# EAGLE board lamloei_umo32c_r2_1 (EAGLE 7.7.0)
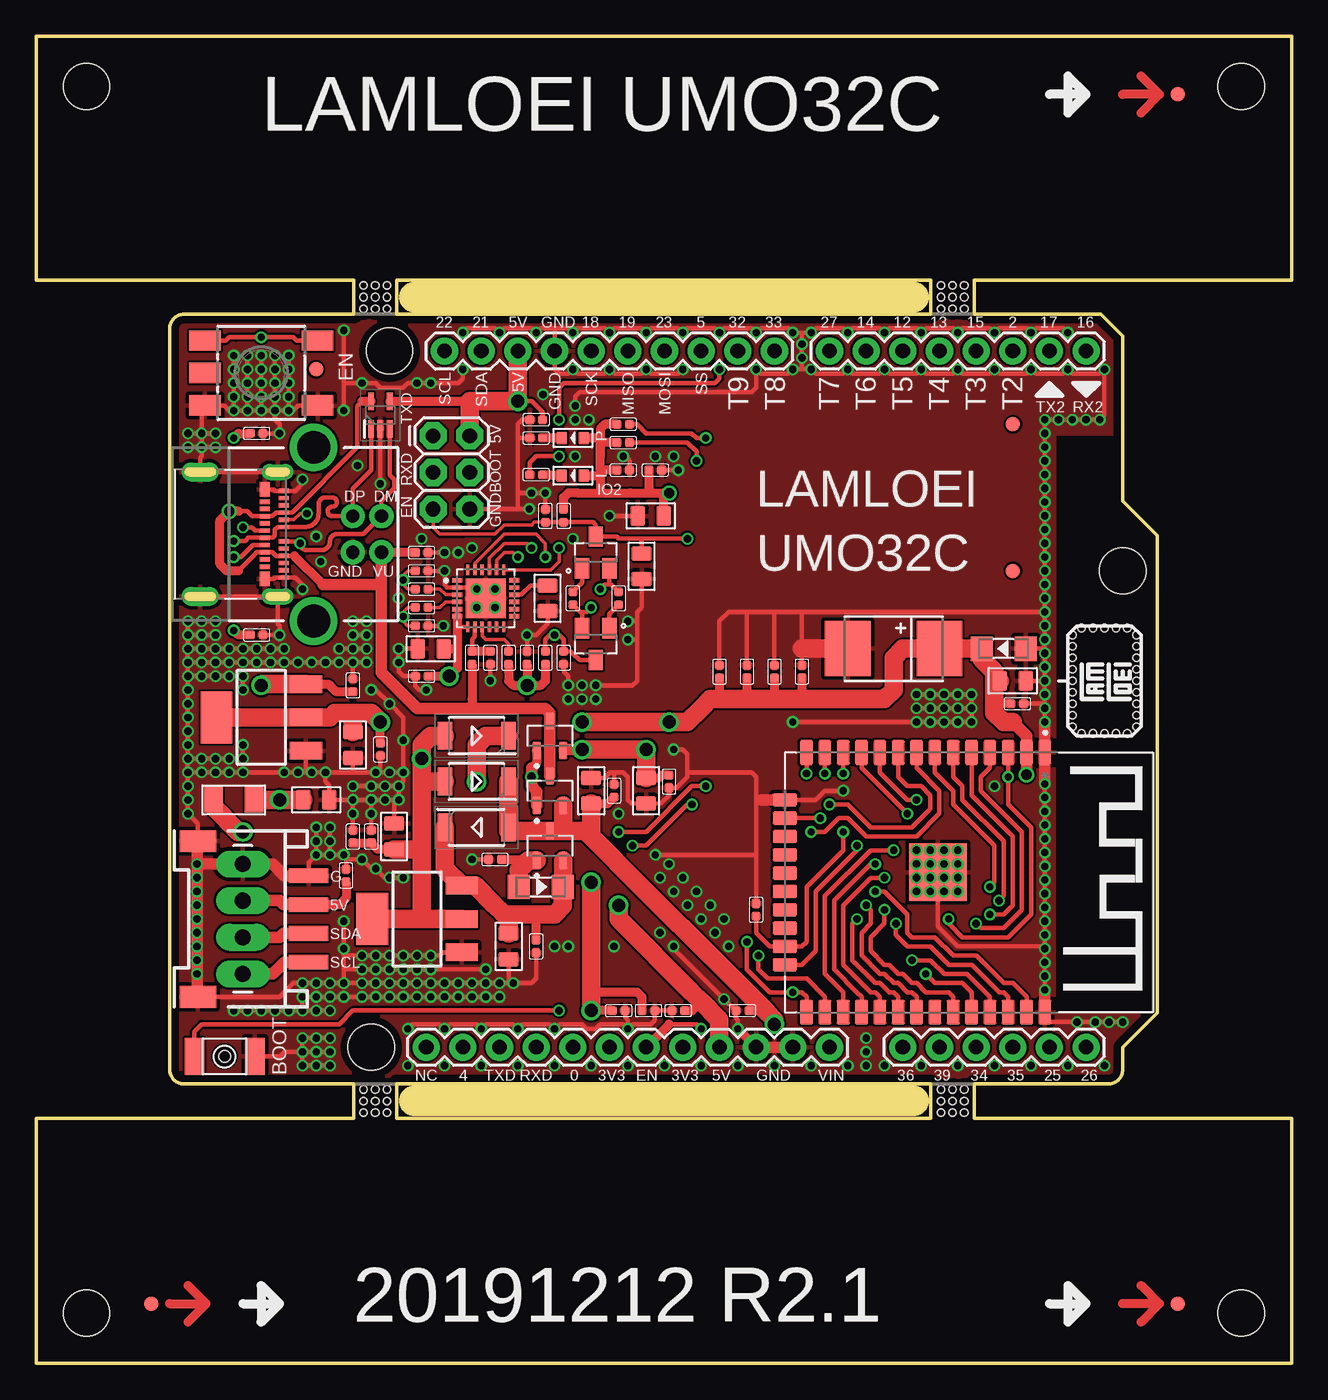
[diagram p1: board, top side]
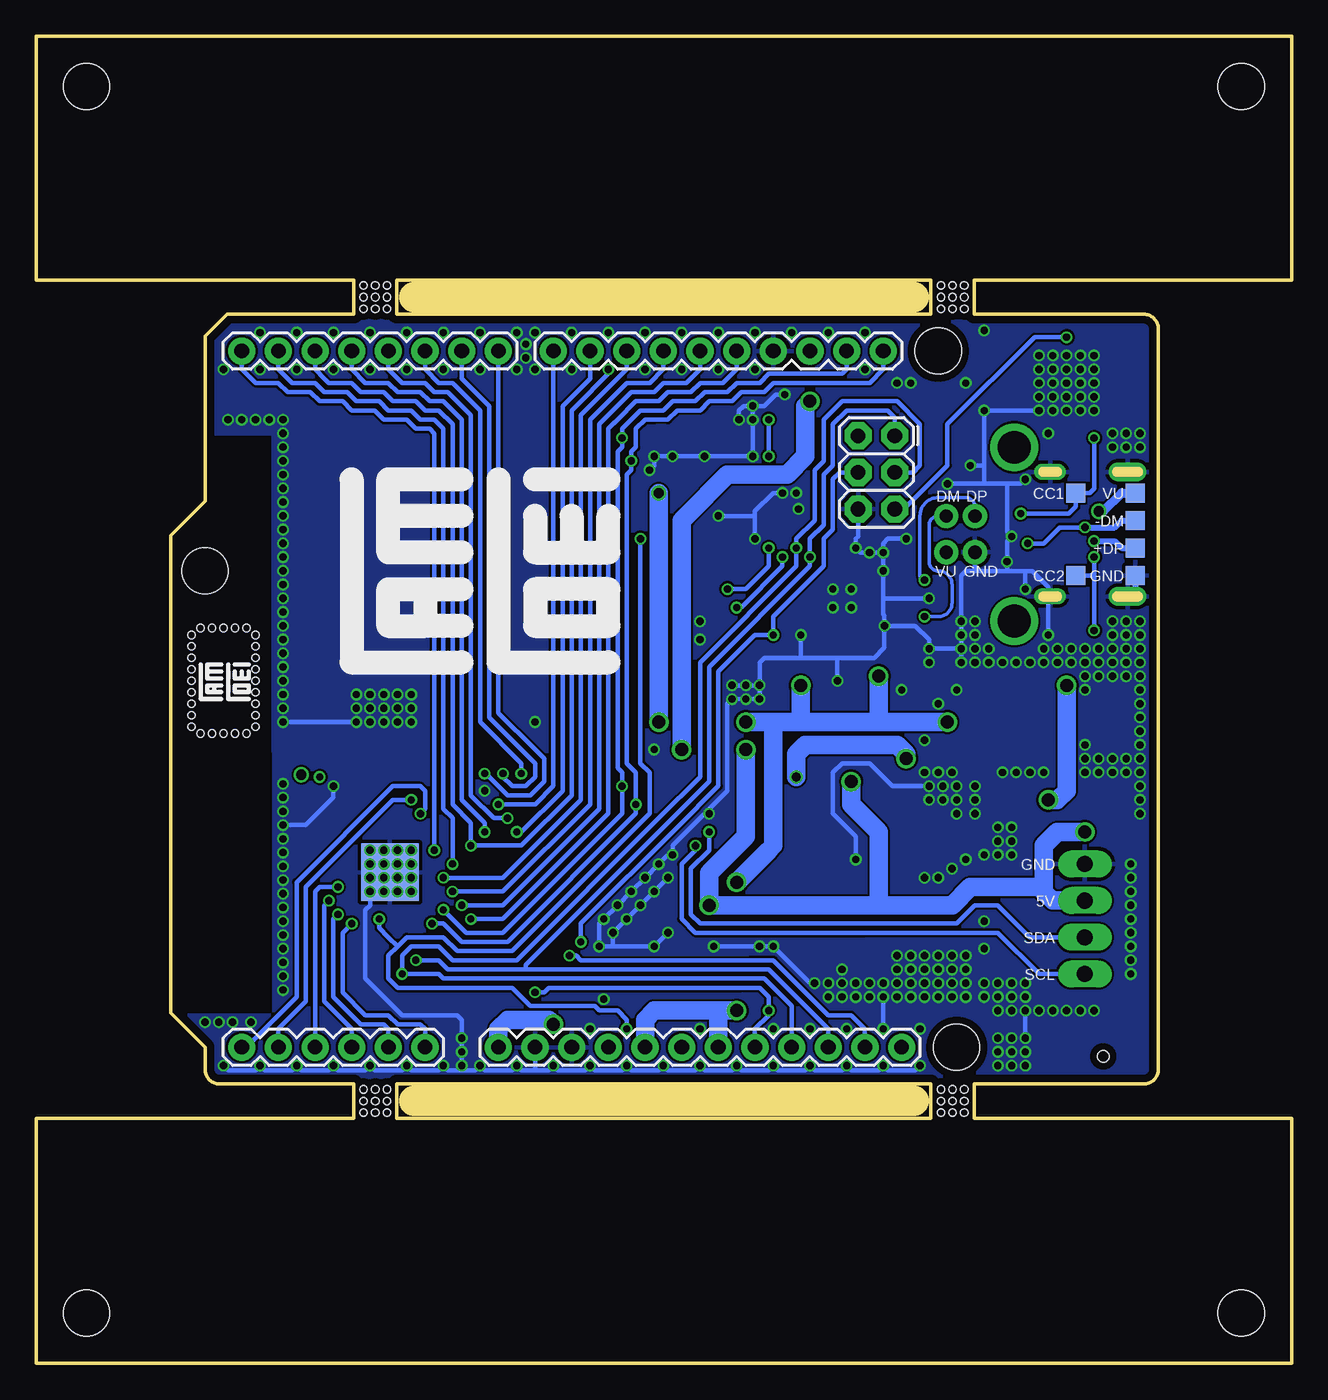
[diagram p2: board, bottom side, seen from below]

Size 87 x 92 mm. Coordinates in mm from the lower left corner, seen from the top.
Outline: 73.77,72.72 75.29,71.19 75.29,59.76 77.67,57.38 77.67,24.3 75.29,21.91 75.29,20.38 arc-90 74.29,19.38 65,19.38 65,17 87,17 87,0 0,0 0,17 22,17 22,19.38 10.25,19.38 arc-90 9.25,20.38
Outline: 9.25,20.39 9.25,71.72 arc-90 10.25,72.72 22,72.72 22,75.09 0,75.09 0,92 87,92 87,75.09 65,75.09 65,72.72 73.75,72.72
Outline: 62,19.38 25,19.38 25,17 62,17 62,19.38
Outline: 62,72.72 62,75.09 25,75.09 25,72.72 62,72.72
Copper layers (1*16): Top 0.035mm / dielectric 1.6mm / Bottom 0.035mm
Design rules "Elecrow_2-layer_PCB_eagle_rule-40": minimum track width 6mil, minimum drill 12mil, track to track 6mil, track to pad 6mil, pad to pad 6mil, via to via 8mil, smd to smd 0mil, copper to edge 20mil, drill to drill 10mil, minimum pad ring 6mil, minimum via ring 6mil, stop-mask expansion 0mil, vias tented up to drill 40mil, thermal gap 10mil
Net classes: 0 default: width 0.254 mm, clearance 0.152 mm; 1 power: width 0.61 mm, drill 0.61 mm, clearance 0.152 mm; 2 gnd: width 0.305 mm, drill 0.483 mm, clearance 0.152 mm; 3 usbvcc: width 0.508 mm, drill 0.61 mm, clearance 0.152 mm; 4 aref: width 0.406 mm, drill 0.61 mm, clearance 0.152 mm
Holes 3.2 mm at 75.29,54.94 24.49,70.17 23.22,21.91 3.5,88.5 3.5,3.5 83.5,88.5 83.5,3.5
Holes 0.8 mm at 13.06,21.28
Holes 0.5 mm at 23.5,19 22.69,19 24.31,19 63.5,19 64.31,19 62.69,19 22.69,18.19 22.69,17.38 23.5,17.38 23.5,18.19 24.31,18.19 24.31,17.38 63.5,18.19 62.69,18.19 62.69,17.38 63.5,17.38 64.31,17.38 64.31,18.19 63.5,73.09 23.5,73.09 24.31,73.09 22.69,73.09 23.5,73.91 24.31,73.91 22.69,73.91 22.69,74.72 23.5,74.72 24.31,74.72 64.31,73.09 62.69,73.09 63.5,73.91 64.31,73.91 62.69,73.91 62.69,74.72 63.5,74.72 64.31,74.72 72.43,43.66 71.8,44.14 73.23,43.66 74.02,43.66 74.81,43.66 75.61,43.66 76.24,44.14 71.8,44.93 71.8,45.73 71.8,46.52 71.8,47.31 71.8,48.11 71.8,48.9 71.8,50.49 71.8,49.7 72.43,50.97 73.23,50.97 74.02,50.97 74.81,50.97 75.61,50.97 76.24,50.49 76.24,44.93 76.24,45.73 76.24,46.52 76.24,47.31 76.24,48.11 76.24,48.9 76.24,49.7
Milling: 2 lines

## Footprints (pad centres in the part's own frame; a part is rotated, then mirrored left to right if it is on the bottom)
C0402 = smd 0.635 x 0.635: 1 0,0.445; 2 0,-0.445
C0805 = smd 1.397 x 1.016: 1 0,0.889; 2 0,-0.889
TE-D-7343 = smd 3.175 x 3.81: + 3.175,0; - -3.175,0
SODFL4725X110N = smd 1 x 1.93: 1 -2.2,0; 2 2.2,0
LL-34 = smd 1.524 x 1.676: A -1.524,0; C 1.524,0
F1206 = smd 1.27 x 1.778: 1 -1.397,0; 2 1.397,0
1X08 = drill 1.016 pad 1.88: 1 0,0; 2 2.54,0; 3 5.08,0; 4 7.62,0; 5 10.16,0; 6 12.7,0; 7 15.24,0; 8 17.78,0
1X10 = drill 1.016 pad 1.88: 1 0,0; 2 2.54,0; 3 5.08,0; 4 7.62,0; 5 10.16,0; 6 12.7,0; 7 15.24,0; 8 17.78,0; 9 20.32,0; 10 22.86,0
1X06 = drill 1.016 pad 1.88: 1 0,0; 2 2.54,0; 3 5.08,0; 4 7.62,0; 5 10.16,0; 6 12.7,0
1X12 = drill 1.016 pad 1.88: 1 0,0; 2 2.54,0; 3 5.08,0; 4 7.62,0; 5 10.16,0; 6 12.7,0; 7 15.24,0; 8 17.78,0; 9 20.32,0; 10 22.86,0; 11 25.4,0; 12 27.94,0
2X3 = drill 1.016 pad 1.88 octagon: 1 0,0; 2 0,2.54; 3 2.54,0; 4 2.54,2.54; 5 5.08,0; 6 5.08,2.54
HW4-SMD-2.0-90D = smd 1.01 x 2.74: 1 -3,-0.1; 2 -1,-0.1; 3 1,-0.1; 4 3,-0.1 | smd 1.5 x 2.54: SS1 -5.4,7.559; SS2 5.4,7.559
1X04_LONGPADS = drill 1.118 pad 1.88 long: 1 0,0; 2 2.54,0; 3 5.08,0; 4 7.62,0
SKHM = smd 2.2 x 1.4: 1 -3.9,2.25; 2 3.9,2.25; 3 -3.9,-2.25; 4 3.9,-2.25; 5 3.9,0
SW2-SMD-3.0X2.5X1.2+0.4MM = smd 1.346 x 2.54: 1 -2.095,0; 2 2.095,0
LED-0603 = smd 0.762 x 0.889: + -0.762,0; - 0.762,0
SOT23 = smd 1.4 x 1: 1 -1.1,0.95; 2 -1.1,-0.95; 3 1.1,0
SOT91P240X110-3N_DMG2305UX-7 = smd 1.18 x 0.61: 1 -1.025,0.915; 2 -1.025,-0.915; 3 1.025,0
R0402 = smd 0.635 x 0.635: 1 0,0.445; 2 0,-0.445
TP13SQ = smd 1.3 x 1.3: TP 0,0
MODULE_ESP-WROOM-32 = smd 1.7 x 0.9: 1 -9,8.255; 2 -9,6.985; 3 -9,5.715; 4 -9,4.445; 5 -9,3.175; 6 -9,1.905; 7 -9,0.635; 8 -9,-0.635; 9 -9,-1.905; 10 -9,-3.175; 11 -9,-4.445; 12 -9,-5.715; 13 -9,-6.985; 14 -9,-8.255; 25 9,-8.255; 26 9,-6.985; 27 9,-5.715; 28 9,-4.445; 29 9,-3.175; 30 9,-1.905; 31 9,-0.635; 32 9,0.635; 33 9,1.905; 34 9,3.175; 35 9,4.445; 36 9,5.715; 37 9,6.985; 38 9,8.255 | smd 4 x 4: 1.1 -0.7,0.845 | smd 4 x 4 bottom: 1.2 -0.7,0.845 | smd 0.9 x 1.7: 15 -5.715,-9.755; 16 -4.445,-9.755; 17 -3.175,-9.755; 18 -1.905,-9.755; 19 -0.635,-9.755; 20 0.635,-9.755; 21 1.905,-9.755; 22 3.175,-9.755; 23 4.445,-9.755; 24 5.715,-9.755
CP2104-F03-GMR = smd 0.7 x 0.25: 1 -1.975,1.25; 2 -1.975,0.75; 3 -1.975,0.25; 4 -1.975,-0.25; 5 -1.975,-0.75; 6 -1.975,-1.25; 13 1.975,-1.25; 14 1.975,-0.75; 15 1.975,-0.25; 16 1.975,0.25; 17 1.975,0.75; 18 1.975,1.25 | smd 0.25 x 0.7: 7 -1.25,-1.975; 8 -0.75,-1.975; 9 -0.25,-1.975; 10 0.25,-1.975; 11 0.75,-1.975; 12 1.25,-1.975; 19 1.25,1.975; 20 0.75,1.975; 21 0.25,1.975; 22 -0.25,1.975; 23 -0.75,1.975; 24 -1.25,1.975 | smd 2.75 x 2.75: 25 0,0
SOT223 = smd 1.219 x 2.235: 1 -2.311,-3.099; 2 0,-3.099; 3 2.311,-3.099 | smd 3.6 x 2.2: 4 0,3.099
SOT65P210X110-5N = smd 1.2 x 0.4: 1 -0.95,0.65; 2 -0.95,0; 3 -0.95,-0.65; 4 0.95,-0.65; 5 0.95,0.65
105450-0101 = smd 0.3 x 0.7: A1 -3,3.77; A2 -2.5,3.77; A3 -2,3.77; A4 -1.5,3.77; A5 -1,3.77; A6 -0.5,3.77; A7 0.5,3.77; A8 1,3.77; A9 1.5,3.77; A10 2,3.77; A11 2.5,3.77; A12 3,3.77; B2 2.25,2.47; B3 1.75,2.47; B4 1.25,2.47; B5 0.75,2.47; B6 0.25,2.47; B7 -0.25,2.47; B8 -0.75,2.47; B9 -1.25,2.47; B10 -1.75,2.47; B11 -2.25,2.47 | smd 1 x 0.7: B1 3.1,2.47; B12 -3.1,2.47 | drill 0.6 pad 1.1 long: S1 -4.32,3.36; S2 4.32,3.36 | drill 0.6 pad 1.3 long: S3 -4.32,-2; S4 4.32,-2
USB-B-PTH = drill 0.914 pad 1.676: D+ 0,1.25; D- 1.981,1.25; GND 0,-1.25; VBUS 1.981,-1.25 | drill 2.286: S1 -2.718,-6.02; S2 -2.718,6.02
FIDUCIAL-1X2 = smd 1 x 1: 1 0,0

## Placement (x,y rotation side)
C1  100nf  [C0402]  26.71,56.2 270 top
C2  NC  [C0402]  26.71,54.94 270 top
C3  NC  [C0402]  26.71,51.12 270 top
C4  4.7uf  [C0805]  27.35,49.54 90 top
C5  100nf  [C0402]  26.71,47.63 90 top
C6  100nf  [C0402]  34.02,48.9 0 top
C7  100nf  [C0402]  36.55,48.9 180 top
C8  4.7uf  [C0805]  35.44,53.03 180 top
C9  100nf  [C0402]  34.65,65.41 90 top
C10  100nf  [C0402]  40.68,61.92 270 top
C11  100nf  [C0402]  42.91,61.92 270 top
C12  100nf  [C0402]  35.28,58.74 0 top
C13  4.7uf  [C0805]  42.59,58.74 90 top
C14  4.7uf  [C0805]  41.95,55.25 180 top
C15  100nf  [C0402]  21.95,47 0 top
C16  4.7uf  [C0805]  21.95,42.87 180 top
C17  100nf  [C0402]  23.86,42.55 180 top
C18  4.7uf  [C0805]  19.41,39.06 270 top
C19  100nf  [C0402]  21.95,36.52 0 top
C20  100nf  [C0402]  23.22,36.52 0 top
C21  4.7uf  [C0805]  24.81,36.52 0 top
C22  100nf  [C0402]  21.47,33.82 0 top
C23  4.7uf  [C0805]  32.75,28.9 180 top
C24  100nf  [C0402]  34.65,28.9 180 top
C25  4.7uf  [C0805]  38.46,39.7 0 top
C26  100nf  [C0402]  40.05,39.7 0 top
C27  4.7uf  [C0805]  42.27,39.7 180 top
C28  100nf  [C0402]  43.86,40.33 180 top
C29  100nf  [C0402]  40.36,24.45 270 top
C30  100nf  [C0402]  42.43,24.45 270 top
C31  100nf  [C0402]  44.49,24.45 90 top
C32  100nf  [C0402]  48.94,24.45 90 top
C33  100nf  [C0402]  67.99,45.73 270 top
C34  4.7uf  [C0805]  67.67,47.31 270 top
C35  470uf  [TE-D-7343]  59.41,49.54 0 top
C36  10nf  [C0402]  53.06,47.95 0 top
C37  1nf  [C0402]  51.16,47.95 0 top
C38  100pf  [C0402]  49.26,47.95 0 top
C39  10pf  [C0402]  47.35,47.95 0 top
D1  PMEG4050EP,115  [SODFL4725X110N]  30.52,43.5 180 top
D2  PMEG4050EP,115  [SODFL4725X110N]  30.52,40.33 180 top
D3  PMEG4050EP,115  [SODFL4725X110N]  30.52,37.16 0 top
D4  12V  [LL-34]  34.97,33.03 0 top
D5  3V6  [LL-34]  67.03,49.54 180 top
F1  SMD1206R500SF  [F1206]  13.7,39.06 0 top
J1  [1X08]  72.75,70.17 180 top
J2  [1X10]  51.16,70.17 180 top
J3  [1X06]  72.75,21.91 180 top
J4  [1X12]  54.97,21.91 180 top
J5  FEMALE 2x3  [2X3]  27.51,64.3 270 top
J6  4P-SMD-2.0-90D  [HW4-SMD-2.0-90D]  18.77,30.8 90 top
J7  [1X04_LONGPADS]  14.33,34.62 270 top
K1  SKHM  [SKHM]  15.6,68.65 180 top
K2  B3U-1000P  [SW2-SMD-3.0X2.5X1.2+0.4MM]  13.06,21.28 180 top
LED1  BLUE-0603  [LED-0603]  37.19,64.14 180 top
LED2  YELLOW-0603  [LED-0603]  37.19,61.54 180 top
Q1  MMBT3904LT1G  [SOT23]  38.78,56.2 90 top
Q2  MMBT3904LT1G  [SOT23]  38.78,49.86 270 top
Q3  DMG2305UX-7  [SOT91P240X110-3N_DMG2305UX-7]  35.6,43.5 90 top
Q4  DMG2305UX-7  [SOT91P240X110-3N_DMG2305UX-7]  35.6,39.7 90 top
Q5  DMG2305UX-7  [SOT91P240X110-3N_DMG2305UX-7]  35.6,35.89 90 top
R1  5.1K  [R0402]  15.28,64.46 270 top
R2  5.1K  [R0402]  15.28,50.49 270 top
R3  0R  [R0402]  26.71,53.66 90 top
R4  0R  [R0402]  26.71,52.4 90 top
R5  24K  [R0402]  30.2,48.9 0 top
R6  47K  [R0402]  31.48,48.9 0 top
R7  12K  [R0402]  32.75,48.9 180 top
R8  12K  [R0402]  35.28,48.9 0 top
R9  12K  [R0402]  37.19,53.03 180 top
R10  12K  [R0402]  40.36,53.03 0 top
R11  2.2K  [R0402]  34.65,64.14 90 top
R12  2.2K  [R0402]  34.65,61.6 90 top
R13  100K  [R0402]  40.68,65.09 270 top
R14  100K  [R0402]  40.68,63.83 270 top
R15  12K  [R0402]  36.55,58.74 180 top
R16  12K  [R0402]  49.89,31.44 0 top
R17  100K  [R0402]  31.79,34.93 90 top
TP1  TPSQTP13SQ  [TP13SQ]  10.84,60.33 0 bottom
TP2  TPSQTP13SQ  [TP13SQ]  10.84,58.43 0 bottom
TP3  TPSQTP13SQ  [TP13SQ]  10.84,56.52 0 bottom
TP4  TPSQTP13SQ  [TP13SQ]  10.84,54.62 0 bottom
TP5  TPSQTP13SQ  [TP13SQ]  14.96,60.33 0 bottom
TP6  TPSQTP13SQ  [TP13SQ]  14.96,54.62 0 bottom
U1  ESP-WROOM-32  [MODULE_ESP-WROOM-32]  61.64,33.34 270 top
U2  CP2104-F03-GMR  [CP2104-F03-GMR]  31.16,53.03 0 top
U3  [SOT223]  15.6,44.77 90 top
U4  [SOT223]  26.39,30.8 90 top
U5  ESDA6V1W5  [SOT65P210X110-5N]  23.86,65.73 90 top
USB1  105450-0101  [105450-0101]  13.38,57.48 270 top
USB2  USB-B  [USB-B-PTH]  21.95,57.48 0 top
ZFC1  FIDUCIAL1X2  [FIDUCIAL-1X2]  19.41,68.91 0 top
ZFC2  FIDUCIAL1X2  [FIDUCIAL-1X2]  67.67,65.09 0 top
ZFC3  FIDUCIAL1X2  [FIDUCIAL-1X2]  67.67,54.94 0 top
ZFD1  FIDUCIAL1X2  [FIDUCIAL-1X2]  79.1,87.95 0 top
ZFD2  FIDUCIAL1X2  [FIDUCIAL-1X2]  7.98,4.13 0 top
ZFD3  FIDUCIAL1X2  [FIDUCIAL-1X2]  79.1,4.13 0 top
ZL1  LAMLEOI_LOGO_3  [LAMLEOI_LOGO_3]  72.12,45.73 0 top
ZL2  LAMLEOI_LOGO_3  [LAMLEOI_LOGO_3]  75.92,45.73 0 bottom
ZL3  LAMLOEI_BIGLOGO  [LAMLOEI_BIGLOGO]  65.13,48.59 0 bottom

## Tracks (layer width: path | path; a pad name or v marks a point on that pad's centre or on a via)
3.3V  (via drill 0.7, 0.9)
  Top 0.305: U2.7 29.25,51.05 29.18,51.12 | U2.5 U2.6
  Top 0.61: U2.6 29.18,51.12 29.18,49.78 29.18,49.54 | C4.2 29.18,49.54 | R7.1 32.75,47.95 32.75,47.31 33.06,47 v34.02,47 | R8.2 35.28,47.31 34.97,47 v34.02,47 | C6.2 v34.02,47 | R15.2 36.55,60.02 36.87,60.33 37.51,60.33 39.09,60.33 | 39.09,61.92 39.09,62.87 | 39.09,63.83 39.09,62.87 | 39.09,62.87 39.09,63.83 | 39.09,63.83 39.09,64.14 | 39.09,64.14 LED1.+ | R13.2 39.41,65.09 39.09,64.78 39.09,64.14 | R14.2 39.09,63.83 | 39.09,60.33 41.16,60.33 | 41.16,60.33 42.27,60.33 | 42.27,60.33 42.75,60.33 v43.86,60.33 43.48,60.33 C13.2 | 39.09,61.92 39.09,61.44 | 39.09,61.44 39.09,60.33 | LED2.+ 39,61.54 39.09,61.44 | C10.2 39.09,61.92 | C11.2 42.46,60.33 42.27,60.33 | 41.19,60.33 41.16,60.33 | C29.2 v38.46,24.45 | C30.2 41.98,25.38 41.63,25.73 38.46,25.73 | C17.2 v23.86,44.46 | 29.18,49.54 29.18,48.2 v28.62,47.63 C5.2 | C33.2 66.4,45.73 | C39.2 47.35,46.05 | C38.2 49.26,46.05 | C37.2 51.16,46.05 | C36.2 53.06,46.68 53.06,46.05
  Top 0.813: v68.62,40.81 U1.2 68.62,43.5 67.67,44.46
  Top 1.27: U3.4 U3.2 20.36,44.77 20.68,45.09 21.95,45.09 | v37.83,44.46 v43.86,44.46 45.13,44.46 46.08,45.41 46.72,46.05 47.35,46.05 49.26,46.05 51.16,46.05 53.06,46.05 58.78,46.05 59.41,46.68 59.41,48.9 60.05,49.54 C35.+ D5.C 65.51,48.84 65.77,48.59 66.4,47.95 66.4,47.63 66.4,47.31 | 21.95,45.09 23.22,45.09 v23.86,44.46 | C16.2 21.95,45.09 | 67.67,44.46 67.03,44.46 66.4,45.09 66.4,45.73 66.4,47.31 | C34.2 66.4,47.31 | v38.46,33.34 38.46,31.44 38.46,25.73 v38.46,24.45
  Bottom 1.27: J4.5 44.81,23.82 44.17,24.45 C29.2 | C29.2 v38.46,24.45 | J4.7 39.73,24.26 C29.2 | v43.86,44.46 v43.86,60.33 | v37.83,44.46 36.55,44.46 35.6,44.46 | 35.6,44.46 34.02,44.46 | 34.02,44.46 28.62,44.46 | 28.62,44.46 v23.86,44.46 | v28.62,47.63 28.62,44.46 | v34.02,47 34.02,44.46 | v38.46,33.34 36.24,35.57 35.92,35.89 35.92,44.14 35.6,44.46
5V  (via drill 0.9)
  Top 0.305: C9.2 35.09,65.92 34.33,66.68 v33.38,66.68
  Top 0.406: U5.4
  Top 0.61: U5.4 30.05,66.68 | J6.3 21.05,31.8 21.31,32.08 21.47,32.23 C22.2 | 36.59,42.55 Q3.2 | C31.2 45.45,24.45 46.08,25.09 | C28.2 43.35,40.77 43.22,40.65 43.16,40.58 C27.2
  Top 0.813: J6.3 17.14,31.8 16.87,32.08 J7.2 | v37.83,42.55 36.59,42.55
  Top 1.27: J5.2 30.05,66.68 v33.38,66.68 J2.8 | F1.1 12.3,38.55 14.01,36.84 v14.33,36.84 | v37.83,42.55 38.46,42.55 v42.27,42.55 C27.2 | D1.1 31.16,43.5 30.52,42.87 v30.52,40.33 | J4.4 47.35,23.82 46.08,25.09 45.45,25.73 40.36,30.8 v40.36,31.76
  Bottom 1.27: J7.2 16.55,32.08 17.03,32.55 | 17.03,32.55 17.19,32.71 17.19,33.03 | 17.19,33.03 17.19,35.89 16.23,36.84 v14.33,36.84 | v42.27,42.55 42.27,42.87 42.27,43.19 42.27,54.62 42.27,58.43 41.95,58.74 39.09,61.6 34.97,61.6 33.7,62.87 33.7,66.37 v33.38,66.68 | 17.51,33.03 17.03,32.55 | v37.83,42.55 37.83,36.52 40.36,33.98 v40.36,31.76 30.52,31.76 28.62,31.76 | 28.62,31.76 23.54,31.76 22.27,33.03 17.19,33.03 | v30.52,40.33 30.52,38.74 28.62,36.84 28.62,31.76
DM  (via drill 0.5)
  Top 0.254: C3.2 25.76,51.12 25.44,51.44 v25.44,51.76 25.44,52.08 25.76,52.4 26.08,52.4 R4.1
  Top 0.305: USB1.A7 18.16,56.98 v18.3,56.84 arc90 18.77,56.36 19.73,56.36 arc90 20.36,57 arc-90 20.84,57.48 22.68,57.48 USB2.D- 23.93,59.77 24.82,60.66 24.82,61.27 24.51,61.59 U5.3 | USB1.B7 15.19,57.73 14.96,57.95 v14.33,57.95
  Bottom 0.254: v25.44,51.76 24.49,51.76 arc-90 23.54,52.71 23.54,53.98 arc-90 24.49,54.94 arc90 25.12,55.57 25.12,58.11 arc90 24.51,58.73 USB2.D-
  Bottom 0.305: v14.33,57.95 16.08,57.95 17.19,56.84 v18.3,56.84
  Bottom 0.406: v14.33,57.95 12.27,57.95 11.79,58.43 TP2.TP
DP  (via drill 0.5)
  Top 0.254: R3.1 25.76,53.66 25.44,53.98 v25.44,54.3 25.44,54.62 25.76,54.94 26.08,54.94 C2.2
  Top 0.305: U5.1 23.2,61.91 21.95,60.65 USB2.D+ 20.54,58.73 arc-90 20.2,59.06 arc-90 20.52,59.38 arc90 20.84,59.7 arc90 20.52,60.02 20.05,60.02 arc90 19.57,59.54 19.57,58.9 arc-90 18.64,57.98 USB1.A6 16.73,57.98 16.55,57.79 16.55,57.4 16.38,57.23 USB1.B6 14.71,57.23 14.49,57 v13.7,57
  Bottom 0.254: USB2.D+ 21.95,59.38 arc-90 22.59,60.02 24.49,60.02 arc-90 25.76,58.74 25.76,54.62 arc-90 v25.44,54.3
  Bottom 0.406: v13.7,57 12.27,57 11.79,56.52 TP3.TP
DTR  (via drill 0.5)
  Top 0.254: U2.23 30.41,55.45 32.43,57.48 34.65,57.48 35.28,56.84 v35.28,55.89
  Top 0.305: v38.46,52.4 38.14,52.08 37.83,52.08 | 37.83,52.08 37.7,52.08 R9.1 | Q2.2 37.83,52.08
  Bottom 0.305: v38.46,52.4 38.14,52.4 35.28,55.25 v35.28,55.89
EN  (via drill 0.5)
  Top 0.254: C12.2 34.52,58.3 34.33,58.11 32.43,58.11 31.79,57.48 29.57,57.48 27.98,57.48 27.51,57.95 J5.5
  Top 0.305: K1.4 13.15,70.9 13.38,71.13 13.85,71.13 | K1.3 18.05,70.9 17.82,71.13 v15.6,71.13 | v15.6,71.13 13.85,71.13 | U1.3 v67.35,40.65 67.35,38.74 68.94,37.16 68.94,31.12 67.35,29.54 64.18,29.54 63.23,30.49 v63.23,30.8 | v15.6,71.13 13.85,71.13 | C12.2 R15.1 38.14,58.3 | 38.14,58.3 38.59,58.3 38.78,58.11 Q1.3 40.22,57.3 40.36,57.16 41.95,57.16 | 38.02,58.3 38.14,58.3 | 45.76,23.5 v46.08,23.18 45.76,23.5 | 43.86,23.5 45.76,23.5 | 41.95,57.16 v45.13,57.16 | C14.2 41.95,57.16
  Top 0.61: J4.6 43.86,23.5
  Bottom 0.305: J5.5 26.87,59.22 23.86,62.24 23.86,65.09 17.82,71.13 v15.6,71.13 | v63.23,30.8 63.23,30.17 62.59,29.54 61.95,28.9 | 61.95,28.9 62.59,28.27 62.59,26.68 61.95,26.04 60.05,26.04 54.02,26.04 53.38,25.41 52.75,24.77 48.3,24.77 47.98,24.45 46.72,24.45 46.08,23.82 v46.08,23.18 | 61.95,28.9 61.32,29.54 60.05,29.54 58.78,29.54 57.83,28.58 54.02,28.58 45.13,37.47 44.49,38.11 44.49,40.97 45.13,41.6 45.13,55.89 45.13,56.2 v45.13,57.16
GND  (via drill 0.5)
  Top 0.305: K1.2 13.02,66.4 13.38,66.05 v13.7,66.05 | K1.1 18.18,66.4 17.82,66.05 v17.51,66.05 | v55.92,39.7 54.65,39.7 54.02,39.06 U1.15 | v61,32.71 v61.95,32.71 v62.91,32.71 v63.86,32.71 | v61,33.66 v61.95,33.66 | 62.52,34.05 v62.91,33.66 | v69.89,25.88 v69.89,26.84 v69.89,27.79 v69.89,28.74 69.89,28.9 | U1.38 69.89,23.98 70.21,23.66 v72.12,23.66 v73.39,23.66 v74.34,23.66 v75.29,23.66 | v13.7,66.05 v14.65,66.05 | v14.65,66.05 v15.6,66.05 | v15.6,66.05 v16.55,66.05 | R1.1 v16.87,64.46 16.87,65.09 16.55,65.41 v16.55,66.05 | R2.1 v16.87,50.49 16.87,51.12 16.74,51.26 USB1.S2 14.96,53.16 USB1.S4 | 11.47,66.17 K1.2 | USB1.S1 14.96,61.8 USB1.S3 11.38,62.78 11.47,62.87 v11.47,63.51 | 16.57,60.48 16.55,60.49 | USB1.B12 16.47,60.58 16.55,60.49 | USB1.B1 16.47,54.38 16.55,54.46 16.57,54.48 USB1.A12 17.96,54.48 18.46,53.98 v18.46,53.66 | U5.2 v23.86,60.97 | v21.31,66.05 21.31,67.95 | 21.31,67.95 v21.31,71.6 | 31.16,53.66 31.16,53.78 U2.2 28.5,53.78 28.3,53.98 v28.3,54.94 C2.1 | 31.16,53.66 U2.25 31.16,52.4 | C3.1 v28.22,51.12 | C4.1 v25.12,49.54 v25.12,48.59 25.12,47.95 25.44,47.63 C5.1 26.27,46.97 26.55,46.68 v27.03,46.68 | C1.1 v28.3,56.2 | v31.48,47.31 R6.2 | v69.89,40.17 v69.89,39.22 v69.89,38.27 v69.89,37.31 v69.89,36.36 v69.89,35.41 v69.89,34.46 v69.89,33.5 v69.89,32.55 v69.89,31.6 v69.89,30.65 v69.89,29.69 69.89,28.9 | v10.52,40.97 v10.52,40.01 v10.52,39.06 v10.52,38.11 11.22,37.41 J6.SS2 | v10.52,40.97 v10.52,41.92 | v10.52,41.92 v10.52,42.87 v10.52,43.82 v10.52,44.77 v10.52,45.73 v10.52,46.68 v10.52,47.63 | v10.52,41.92 v11.47,41.92 v12.43,41.92 v13.38,41.92 v14.33,41.92 v14.33,42.87
  Top 0.305: v20.05,40.97 v19.09,40.97 | v19.09,40.97 v18.14,40.97 v17.19,40.97 16.23,40.97 | 16.23,40.97 15.28,40.97 v14.33,40.97 v13.38,40.97 v12.43,40.97 v11.47,40.97 | 16.23,40.97 v10.52,40.97 | v14.33,46.68 v14.33,47.63 v13.38,47.63 v12.43,47.63 v11.47,47.63 v10.52,47.63 | C8.1 35.44,51.28 34.65,50.49 v34.02,50.49 C6.1 | 31.16,52.4 v30.52,52.4 | v30.52,53.66 31.16,53.66 | v31.79,53.66 31.16,53.66 | v31.79,52.4 31.16,52.4 | C7.1 36.55,47.95 36.87,47.63 v36.87,47 | v10.52,48.59 v10.52,47.63 | v10.52,50.49 v10.52,51.44 v11.47,51.44 v12.43,51.44 | v10.52,50.49 v10.52,49.54 | v10.52,48.59 v11.47,48.59 v12.43,48.59 v13.38,48.59 v14.33,48.59 v15.28,48.59 v16.23,48.59 v17.19,48.59 v18.14,48.59 v19.09,48.59 v20.05,48.59 v21,48.59 | C9.1 33.7,65.41 33.38,65.09 33.38,64.78 33.38,64.14 | 33.38,64.14 33.38,60.65 33.38,60.33 | R11.1 33.38,64.14 | v13.7,66.05 v13.7,67 v13.7,67.95 v13.7,68.91 v13.7,69.86 | v16.55,66.05 v17.51,66.05 | v14.65,66.05 v14.65,67 v14.65,67.95 v14.65,68.91 v14.65,69.86 | v15.6,66.05 v15.6,67 v15.6,67.95 v15.6,68.91 v15.6,69.86 | v16.55,66.05 v16.55,67 v16.55,67.95 v16.55,69.86 v16.55,68.91 | v17.51,66.05 v17.51,67 v17.51,67.95 v17.51,69.86 v17.51,68.91 | v44.81,68.91 44.49,68.59 42.59,68.59 v42.27,68.91 41.95,68.59 40.05,68.59 v39.73,68.91 39.41,68.59 37.51,68.59 v37.19,68.91 36.87,68.59 36.24,68.59 35.92,68.91 J2.7 35.92,71.76 | 35.92,71.76 34.97,71.76 v34.65,71.44 34.33,71.76 32.43,71.76 v32.11,71.44 31.79,71.76 29.89,71.76 v29.57,71.44 | 35.92,71.76 36.87,71.76 v37.19,71.44 37.51,71.76 39.41,71.76 v39.73,71.44 40.05,71.76 41.95,71.76 v42.27,71.44 42.59,71.76 44.49,71.76 v44.81,71.44 45.13,71.76 47.03,71.76 v47.35,71.44 47.67,71.76 49.57,71.76 v49.89,71.44 50.21,71.76 52.11,71.76 v52.43,71.44 53.06,71.44
  Top 0.305: v29.57,68.91 29.57,68.27 29.25,67.95 v27.35,67.95 v26.39,67.95 25.76,67.95 25.44,67.63 23.86,67.63 23.54,67.95 v22.59,67.95 21.31,67.95 | 53.06,68.91 v52.43,68.91 52.11,68.59 50.21,68.59 v49.89,68.91 49.89,67.63 49.57,67.32 37.67,67.32 37.35,67 v37.35,66.37 | 53.06,68.91 v53.7,68.91 54.02,68.59 55.92,68.59 v56.24,68.91 56.56,68.59 58.46,68.59 v58.78,68.91 59.1,68.59 61,68.59 v61.32,68.91 61.64,68.59 63.54,68.59 v63.86,68.91 64.18,68.59 66.08,68.59 v66.4,68.91 66.72,68.59 68.62,68.59 v68.94,68.91 69.26,68.59 71.16,68.59 v71.48,68.91 71.8,68.59 73.7,68.59 v74.02,68.91 74.02,65.73 v73.7,65.41 v72.75,65.41 v71.8,65.41 v70.84,65.41 v69.89,65.41 v69.89,64.46 v69.89,63.51 v69.89,62.55 v69.89,61.6 v69.89,60.65 v69.89,59.7 v69.89,58.74 v69.89,57.79 v69.89,56.84 v69.89,55.89 v69.89,54.94 v69.89,53.98 v69.89,53.03 v69.89,52.08 | 53.06,71.44 v53.7,71.44 54.02,71.76 55.92,71.76 v56.24,71.44 56.56,71.76 58.46,71.76 v58.78,71.44 59.1,71.76 61,71.76 v61.32,71.44 61.64,71.76 63.54,71.76 v63.86,71.44 64.18,71.76 66.08,71.76 v66.4,71.44 66.72,71.76 68.62,71.76 v68.94,71.44 69.26,71.76 71.16,71.76 v71.48,71.44 | 69.89,28.9 68.62,28.9 63.86,28.9 62.59,30.17 62.52,30.23 62.48,30.28 62.48,33.66 | v62.91,34.62 62.91,34.47 U1.1.1 | 62.48,33.66 62.48,34.19 62.48,33.66 | v10.52,49.54 v10.52,48.59 | v11.47,50.49 v12.43,50.49 v10.52,50.49 | v10.52,49.54 v11.47,49.54 v12.43,49.54 v13.38,49.54 v14.33,49.54 v15.28,49.54 v17.19,49.54 v16.23,49.54 | v21,48.59 v21.95,48.59 | v21.95,48.59 v22.9,48.59 | v21,49.54 v21.95,49.54 v22.9,49.54 | v21.95,50.49 v22.9,50.49
  Top 0.305: v21.95,51.44 v22.9,51.44 | v18.46,61.28 18.46,60.97 18.14,60.65 17.96,60.48 USB1.A1 16.57,60.48 | 16.57,60.48 16.55,60.49 | v11.47,64.46 11.47,66.17 | 11.47,66.17 K1.2 | v11.47,63.51 v11.47,64.46 | v10.52,63.51 v11.47,63.51 | v10.52,64.46 v11.47,64.46 | v12.43,63.51 v11.47,63.51 | v12.43,64.46 v11.47,64.46 | J5.6 33.06,59.22 33.38,59.22 | 33.38,60.33 33.38,59.54 33.38,59.22 | 33.38,59.22 v34.17,59.22 | 33.38,60.33 v34.33,60.33 v35.28,60.33 C12.1 | C10.1 41.13,62.43 41.13,62.59 40.84,62.87 v40.68,62.87 | C11.1 v44.49,61.92 | v69.89,49.22 v69.89,48.27 v69.89,47.31 | v69.89,49.22 v69.89,50.17 v69.89,51.12 v69.89,52.08 | 21.31,48.59 v21,48.59 | 21.95,40.97 22.59,40.97 v23.54,40.97 | 21.95,40.97 21.31,40.97 v20.05,40.97 | v20.05,40.97 v19.09,40.97 | U3.1 18.7,40.97 v19.09,40.97 | v41,23.18 40.68,23.5 39.09,23.5 38.78,23.18 38.14,23.18 37.83,23.5 36.24,23.5 v35.92,23.18 35.6,23.5 33.7,23.5 v33.38,23.18 33.06,23.5 31.16,23.5 v30.84,23.18 30.52,23.5 28.62,23.5 v28.3,23.18 27.98,23.5 26.08,23.5 v25.76,23.18 | C31.1 C30.1 42.87,23.79 42.59,23.5 41.32,23.5 v41,23.18 | C29.1 40.81,24.01 41,23.82 v41,23.18 | C16.1 21.95,40.97 | C17.1 23.86,41.28 23.86,40.97 v23.54,40.97 | 62.48,33.66 62.48,34.08 62.59,34.19 | 62.48,33.66 v61.95,33.66 | v61.95,33.66 62.59,33.66 62.59,34.3 62.27,34.3 | 62.27,34.3 62.27,33.98 62.27,34.3 | 62.27,34.3 v61.95,34.62 | v21.31,30.65 v21.31,28.74 | v21.31,28.74 21.31,28.27 | 21.31,28.27 21.31,27.31 | 21.31,27.31 v21.31,26.36 | 21.31,28.27 v22.59,28.27 v24.49,28.27 | 21.31,28.27 v21.31,28.74 | 21.31,27.31 v22.59,27.31 v23.54,27.31 v24.49,27.31 v25.44,27.31 v26.39,27.31 v27.35,27.31 28.3,27.31 29.25,27.31 30.2,27.31 v31.16,27.31
  Top 0.305: v21.31,26.36 v22.59,26.36 v24.49,26.36 | v21.31,26.36 v20.36,26.36 v19.41,26.36 v18.46,26.36 | v24.49,28.27 v23.54,28.27 | v24.49,26.36 v23.54,26.36 | J6.SS1 16.87,25.41 17.82,26.36 v18.46,26.36 | C15.1 v21.95,48.59 | v20.05,40.97 20.05,40.33 20.3,40.08 C18.1 v21.95,39.06 | K2.1 16.87,21.28 17.19,21.6 v18.46,21.6 | v18.46,21.6 v18.46,20.64 v20.36,20.64 v19.41,20.64 | v18.46,21.6 v18.46,22.55 v20.36,22.55 v19.41,22.55 | v19.41,21.6 v20.36,21.6 v18.46,21.6 | v13.7,24.45 v14.65,24.45 v15.6,24.45 v16.55,24.45 v17.51,24.45 v18.46,24.45 | v18.46,24.45 v18.46,25.41 | v18.46,25.41 v18.46,26.36 | v20.36,24.45 v19.41,24.45 v18.46,24.45 | v18.46,25.41 v19.41,25.41 v20.36,25.41 v21.31,25.41 v22.59,25.41 v23.54,25.41 v25.44,25.41 | v27.35,28.27 v26.39,28.27 v25.44,28.27 | v27.35,28.27 v24.49,28.27 | v27.35,26.36 v28.3,26.36 v29.25,26.36 v30.2,26.36 v31.16,26.36 v32.11,26.36 v33.06,26.36 | v27.35,26.36 v26.39,26.36 | v27.35,26.36 v25.44,26.36 | v25.44,25.41 v24.49,25.41 | v27.35,26.36 v24.49,26.36 | v25.44,25.41 v26.39,25.41 v27.35,25.41 v28.3,25.41 v29.25,25.41 v30.2,25.41 v31.16,25.41 v32.11,25.41 | v25.44,40.97 25.44,41.92 v25.44,43.19 25.44,44.77 v24.49,45.73 23.54,46.68 v23.22,46.68 | v23.54,40.97 v24.49,40.97 v25.44,40.97 | v38.78,47 41.32,47 41.63,47.31 41.63,50.17 | 41.63,50.17 41.63,51.12 41.63,51.44 | v41,50.17 41.63,50.17 | U4.1 28.21,28.49 27.98,28.27 v27.35,28.27 | R16.1 49.89,34.3 | 49.89,34.3 49.89,35.25 | 49.89,35.25 v42.91,35.25 | 49.89,35.25 49.89,38.74 49.89,39.06 | 49.89,35.25 49.89,34.3 | v69.89,45.41 v69.89,46.36 v69.89,47.31 | C33.1 69.89,45.73 v69.89,45.41 | C34.1 v69.89,47.31
  Top 0.305: 49.89,39.06 49.89,40.65 49.57,40.97 45.45,40.97 45.13,40.97 | 50.21,39.06 49.89,39.06 | 53.06,68.91 v53.06,69.7 | 53.06,68.91 v53.06,70.65 53.06,71.44 | C13.1 v39.73,58.74 | C14.1 41.95,52.4 41.63,52.08 41.63,51.44 | v41,51.44 41.63,51.44 | v69.89,45.41 v69.89,44.46 | D5.A 69.89,49.54 v69.89,49.22 | v69.89,52.08 56.56,52.08 53.06,52.08 | v64.81,45.41 v64.81,44.46 v63.86,44.46 v62.91,44.46 v61.95,44.46 v61,44.46 v52.43,44.46 | v61,45.41 v61.95,45.41 v62.91,45.41 v63.86,45.41 v64.81,45.41 | v61,46.36 v61.95,46.36 v62.91,46.36 v63.86,46.36 v64.81,46.36 v64.81,45.41 | 40.05,40.97 39.73,40.97 39.35,40.58 C25.1 | C26.1 40.05,40.97 | v44.17,28.9 44.17,28.74 v47.67,25.25 48.46,24.45 C32.1 48.49,23.95 48.62,23.82 v48.62,23.18 | R17.1 v30.2,34.93 | C21.1 24.81,39.06 | 24.81,39.06 v24.17,39.06 v23.22,39.06 | 24.81,39.06 v25.12,39.06 v25.12,40.01 | v25.12,40.01 25.44,40.33 v25.44,40.97 | C19.1 v21.95,38.11 v21.95,39.06 | C20.1 v23.22,38.11 v23.22,39.06 | v21.95,39.06 v23.22,39.06 | v21.95,40.01 v23.22,40.01 v24.17,40.01 v25.12,40.01 | 21.47,35.09 v21.31,35.25 | J6.4 18.88,34.72 v19.41,35.25 | v19.41,35.25 v20.36,35.25 | v20.36,35.25 v21.31,35.25 | v20.36,35.25 v20.36,36.2 v20.36,37.16 | v19.41,35.25 v19.41,36.2 v19.41,37.16 | v21.31,35.25 21.63,34.93 v22.59,34.93 23.22,34.3 v23.54,34.3 24.17,33.66 v24.49,33.66 v25.44,33.66 | C22.1 21.47,35.09 | 21.47,35.09 v21.31,35.25 | 40.05,40.97 40.68,40.97 41,40.65 41,39.06 41.25,38.81 C27.1 43.29,38.81 43.54,39.06 43.86,39.38 C28.1 44.37,39.89 44.49,40.01 45.13,40.65 45.13,40.97 | v44.17,42.55 44.81,42.55 45.13,42.23 45.13,40.97 | C23.1 32.75,26.36 v33.06,26.36
  Top 0.305: C24.1 34.65,26.68 34.33,26.36 v33.06,26.36 | 53.06,52.08 51.16,52.08 | 51.16,52.08 49.26,52.08 | 49.26,52.08 47.98,52.08 47.35,51.44 C39.1 | C38.1 49.26,52.08 | C37.1 51.16,52.08 | C36.1 53.06,49.54 53.06,52.08
  Top 0.61: J4.3 v48.62,23.18
  Top 0.813: J4.2 J4.3 | U1.38 v69.89,25.88 | v69.89,40.17 U1.1 v69.89,44.46 | J6.4 17.2,33.8 16.39,34.62 J7.1 v11.15,34.62 | J6.SS2 11.16,36.2 11.15,36.2 v11.15,34.62 | J6.SS1 11.16,25.41 11.15,25.41 v11.15,27 v11.15,27.95 v11.15,28.9 v11.15,29.85 v11.15,30.8 v11.15,31.76 v11.15,32.71 v11.15,33.66 v11.15,34.62 | U1.15 50.21,39.06 | 62.48,34.19 62.59,34.19 62.7,34.19 63.23,33.66 63.01,33.66 62.48,34.19
  Top 1.27: C35.- 53.06,49.54
  Bottom 0.305: 21.31,62.24 21.31,61.76 21.31,60.97 | v22.27,62.24 21.31,62.24 | 21.31,62.24 v21.31,66.05 v17.51,66.05 | v69.89,37.31 68.31,37.31 66.4,39.22 v66.4,40.01 | v63.86,32.71 v62.91,33.66 62.52,34.05 U1.1.1 | v63.86,32.71 63.86,31.76 64.18,31.44 64.18,26.68 61.64,24.14 57.83,24.14 57.51,23.82 v57.51,22.55 v57.51,21.6 v57.51,20.64 57.51,20.33 | U1.1.1 62.55,33.98 62.91,33.98 62.84,34.05 U1.1.1 | U1.1.1 62.48,34.09 | 62.48,34.09 v61.95,34.62 | v61,35.57 v61.95,35.57 v62.91,35.57 v63.86,35.57 | U1.1.1 62.34,34.05 v61.95,33.66 | v63.86,33.66 v63.86,34.62 | v62.91,34.62 62.91,34.47 U1.1.1 | v62.91,34.62 v61.95,34.62 | 61.64,34.62 v61.95,34.62 | v61,34.62 v61.95,34.62 | v62.91,34.62 v63.86,34.62 | v63.86,34.62 v63.86,35.57 | v63.86,35.57 v63.86,32.71 | v23.86,60.97 21.31,60.97 | USB2.GND 21.95,54.94 | 21.95,54.94 22.59,54.94 22.9,54.62 v22.9,51.44 v22.9,50.49 v22.9,49.54 | 21.95,54.94 20.36,54.94 19.73,54.94 | 19.73,54.94 18.46,54.94 | 18.46,54.94 17.98,54.94 17.03,53.98 16.87,53.82 v16.87,50.49 | 19.73,54.94 v19.73,55.57 19.73,57 v19.41,57.32 19.73,57.63 19.73,60.97 | v28.22,51.12 28.22,51.84 28.3,51.92 28.3,53.03 | 28.3,53.03 v25.12,53.03 | 28.3,53.03 v28.3,54.94 v28.3,56.2 | v28.22,51.12 26.08,51.12 25.12,50.17 v25.12,49.54 v22.9,49.54 | v36.87,47 36.87,48.59 36.55,48.9 34.02,48.9 | 34.02,48.9 31.79,48.9 31.48,48.9 | v31.48,47.31 31.48,48.59 31.48,48.9 | v34.02,50.49 34.02,48.9 | 31.48,48.9 28.93,48.9 28.22,49.62 v28.22,51.12 | U1.1.1 62.48,34.09 | 62.48,34.09 v61.95,34.62 | 62.48,34.09 62.48,33.98 62.48,33.66 62.48,34.19 | 62.48,34.19 62.59,34.3 | 62.59,34.3 v62.91,34.62 | v62.91,34.62 62.59,34.3 | 62.59,34.3 62.48,34.19
  Bottom 0.305: 62.48,34.19 62.38,34.19 v61.95,34.62 | v61.95,34.62 62.06,34.62 62.48,34.19 | v58.78,20.64 58.46,20.33 | 57.51,20.33 56.56,20.33 v56.24,20.64 55.92,20.33 54.02,20.33 v53.7,20.64 53.38,20.33 52.43,20.33 | 57.51,20.33 58.46,20.33 | 58.46,20.33 v58.78,20.64 | 52.43,20.33 51.48,20.33 v51.16,20.64 50.84,20.33 48.94,20.33 v48.62,20.64 48.3,20.33 46.4,20.33 v46.08,20.64 45.76,20.33 43.86,20.33 v43.54,20.64 43.22,20.33 41.32,20.33 v41,20.64 40.68,20.33 38.78,20.33 v38.46,20.64 38.14,20.33 36.24,20.33 v35.92,20.64 35.6,20.33 33.7,20.33 v33.38,20.64 33.06,20.33 31.16,20.33 v30.84,20.64 30.52,20.33 28.62,20.33 v28.3,20.64 27.98,20.33 26.08,20.33 v25.76,20.64 | J4.2 52.43,20.33 | v58.78,20.64 59.1,20.33 61,20.33 v61.32,20.64 61.64,20.33 63.54,20.33 v63.86,20.64 64.18,20.33 66.08,20.33 v66.4,20.64 66.72,20.33 68.62,20.33 v68.94,20.64 69.26,20.33 71.16,20.33 v71.48,20.64 71.8,20.33 73.7,20.33 v74.02,20.64 | 62.48,34.19 62.59,34.3 | 62.59,34.3 v62.91,34.62 | v62.91,34.62 62.59,34.3 | 62.59,34.3 62.48,34.19 | v22.9,48.59 v22.9,49.54 | v18.46,53.66 18.46,54.94 | v18.46,61.28 18.77,60.97 19.57,60.97 19.73,60.97 | 19.73,60.97 21.31,60.97 | J5.6 30.05,57.32 30.2,57.16 v30.2,56.52 29.89,56.2 v29.25,56.2 v28.3,56.2 | v28.3,56.2 28.3,56.84 27.98,57.16 v26.71,57.16 | v37.35,66.37 36.55,66.37 35.76,67.16 v35.13,67.16 | v37.35,66.37 37.98,66.37 38.3,66.05 v38.3,65.41 | v37.35,66.37 v37.35,65.41 v37.35,62.87 v40.68,62.87 v42.91,62.87 v44.17,62.87 44.17,62.24 v44.49,61.92 | v35.28,60.33 35.92,60.33 37.19,59.06 37.19,58.74 | 37.19,58.74 v37.19,57.16 | v61.95,34.62 v61.95,33.66
  Bottom 0.305: v61.95,33.66 62.59,34.3 | v36.87,47 v36.87,46.05 v37.83,46.05 v38.78,46.05 39.09,45.73 39.09,39.7 40.36,38.42 v40.36,38.11 40.68,38.11 42.91,35.89 v42.91,35.25 43.22,35.25 v43.86,34.62 v44.81,33.66 v45.76,32.71 v46.72,31.76 v47.67,30.8 47.98,30.49 v47.98,28.9 47.03,28.9 | v36.87,47 v37.83,47 v38.78,47 | v18.46,22.55 v18.46,24.45 | v28.3,23.18 v28.3,25.41 | v33.06,26.36 33.38,26.36 v35.92,28.9 v36.87,28.9 v40.05,28.9 | v39.73,58.74 37.19,58.74 | v69.89,44.46 v64.81,44.46 | v30.2,34.93 30.2,36.52 31.79,38.11 31.79,40.97 31.16,41.6 29.25,41.6 28.3,40.65 27.66,40.01 v25.12,40.01 | v47.03,29.85 v46.08,30.8 v45.13,31.76 v44.17,32.71 | v47.03,29.85 v43.22,33.66 | v47.03,29.85 47.03,28.9 | v43.22,29.85 v44.17,28.9 47.03,28.9
  Bottom 0.406: TP4.TP 10.84,53.16 USB1.S4
  pour Top: 9.25,19.38 77.83,19.38 77.83,24.14 70.53,24.14 70.53,64.46 75.29,64.46 75.29,72.72 9.25,72.72
  pour Bottom: 9.25,19.38 77.83,19.38 77.83,24.14 70.53,24.14 70.53,64.46 75.29,64.46 75.29,72.72 9.25,72.72
IO0  (via drill 0.5)
  Top 0.305: U1.25 53.38,25.41 53.06,25.73 v52.43,25.73 50.84,25.73 49.26,27.31 49.26,28.42 v49.26,29.22 | R8.1 35.28,49.86 35.28,50.17 35.6,50.49 v35.92,50.49 36.24,50.49 36.55,50.17 36.55,49.86 C7.2 37.06,49.35 37.19,49.22 37.66,48.75 Q2.3 | K2.2 10.96,22.99 11.47,23.5 21,23.5 21.95,24.45 35.6,24.45 35.92,24.45 v36.24,24.45
  Bottom 0.305: J5.4 31.32,61.76 31.79,61.28 31.79,57.79 32.43,57.16 32.43,55.25 35.92,51.76 v35.92,50.49 37.19,50.49 39.73,47.95 39.73,40.01 42.59,37.16 49.26,30.49 v49.26,29.22 | v52.43,25.73 51.8,25.73 51.48,26.04 38.14,26.04 36.87,26.04 36.24,25.41 v36.24,24.45 36.24,24.14 37.19,23.18 J4.8
IO2  (via drill 0.5)
  Top 0.305: U1.24 53.06,27.63 54.02,28.58 54.02,32.71 56.88,35.57 v56.88,35.89 | R12.1 34.21,62.43 34.65,62.87 v36.24,62.87 | v47.35,68.91 47.35,68.27 47.03,67.95 37.51,67.95 36.55,67.95 36.24,67.63 v36.24,65.41
  Bottom 0.305: v36.24,62.87 36.24,64.14 36.24,64.3 v36.24,65.41 | v47.35,68.91 47.35,68.59 49.57,66.37 49.89,66.05 49.89,39.38 53.38,35.89 v56.88,35.89 56.88,37.47 58.15,38.74 58.15,65.09 59.1,66.05 60.05,66.05 60.69,66.68 62.27,66.68 62.91,67.32 64.5,67.32 65.13,67.95 66.72,67.95 67.03,68.27 67.67,68.91 J1.3
IO4  (via drill 0.5)
  Top 0.305: U1.26 54.65,25.41 53.38,26.68 50.68,26.68 50.05,27.31 v50.05,28.27
  Bottom 0.305: v50.05,28.27 49.57,28.27 49.26,27.95 37.51,27.95 35.92,27.95 32.11,24.14 30.52,24.14 29.57,23.18 J4.11
IO5  (via drill 0.5)
  Top 0.305: v58.78,33.66 57.83,33.66 55.92,31.76 55.92,31.44 55.92,29.54 55.92,27.63 57.83,25.73 58.15,25.73 58.46,25.41 U1.29
  Bottom 0.305: v58.78,33.66 54.65,33.66 49.26,39.06 49.26,65.73 48.94,66.05 46.08,68.91 J2.3
IO12  (via drill 0.5)
  Top 0.305: U1.14 v53.38,40.89
  Bottom 0.305: v53.38,40.89 53.38,41.6 56.24,44.46 56.24,66.05 58.15,67.95 59.1,67.95 60.05,68.91 J1.6
IO13  (via drill 0.5)
  Top 0.305: v54.34,37.79 U1.16
  Bottom 0.305: v54.34,37.79 55.29,37.79 56.88,39.38 56.88,65.73 58.46,67.32 59.41,67.32 60.05,67.95 61.64,67.95 62.59,68.91 J1.5
IO14  (via drill 0.5)
  Top 0.305: v54.65,40.89 U1.13
  Bottom 0.305: v54.65,40.89 54.65,40.65 54.02,40.01 53.06,40.01 52.43,40.65 52.43,41.6 55.6,44.77 55.6,66.37 57.51,68.27 J1.7
IO15  (via drill 0.5)
  Top 0.305: v55.92,36.84 55.92,35.57 53.38,33.03 53.38,29.22 53.06,28.9 U1.23 50.84,28.9 49.89,29.85 R16.2
  Bottom 0.305: v55.92,36.84 55.92,37.47 57.51,39.06 57.51,65.41 58.78,66.68 59.73,66.68 60.37,67.32 61.95,67.32 62.59,67.95 64.18,67.95 65.13,68.91 J1.4
IO16  (via drill 0.5)
  Top 0.305: v59.41,35.57 57.83,35.57 54.65,32.39 54.65,28.9 54.65,27 55.92,25.73 U1.27
  Bottom 0.305: v59.41,35.57 59.41,47.95 59.41,51.76 59.41,64.46 59.73,64.78 60.69,64.78 61.32,65.41 62.91,65.41 63.54,66.05 65.13,66.05 65.77,66.68 67.35,66.68 67.99,67.32 69.58,67.32 70.21,67.95 71.8,67.95 72.75,68.91 J1.1
IO17  (via drill 0.5)
  Top 0.305: v58.15,34.62 57.83,34.62 55.29,32.08 55.29,29.22 55.29,27.31 56.88,25.73 57.19,25.41 U1.28
  Bottom 0.305: v58.15,34.62 58.15,37.79 58.78,38.42 58.78,49.54 58.78,51.44 58.78,64.78 59.41,65.41 60.37,65.41 61,66.05 62.59,66.05 63.23,66.68 64.81,66.68 65.45,67.32 67.03,67.32 67.67,67.95 69.26,67.95 70.21,68.91 J1.2
IO18  (via drill 0.5)
  Top 0.305: U1.30 59.73,25.41 59.41,25.73 59.1,25.73 58.46,26.36 58.15,26.36 56.56,27.95 56.56,30.49 v56.88,30.8
  Bottom 0.305: J2.6 38.46,68.91 39.41,67.95 41,67.95 41.63,67.32 43.22,67.32 43.86,66.68 45.45,66.68 46.72,65.41 | 46.72,65.41 47.03,65.09 | v56.88,30.8 54.65,30.8 47.35,38.11 47.35,64.78 46.72,65.41
IO19  (via drill 0.5)
  Top 0.305: U1.31 61,25.41 60.69,25.73 60.37,25.73 59.73,26.36 59.41,26.36 58.78,27 58.46,27 57.19,28.27 57.19,29.85 57.83,30.49 57.83,31.44 v57.51,31.76
  Bottom 0.305: v57.51,31.76 54.65,31.76 47.98,38.42 47.98,65.09 47.67,65.41 45.76,67.32 44.17,67.32 43.54,67.95 41.95,67.95 41,68.91 J2.5
IO21  (via drill 0.5)
  Top 0.305: U1.33 63.54,25.41 63.23,25.73 61.64,25.73 61,26.36 60.69,26.36 60.05,27 59.73,27 59.1,27.63 58.78,27.63 57.83,28.58 57.83,29.54 58.78,30.49 v58.78,31.44 | v46.4,64.14 45.76,64.14 45.45,64.46 42.27,64.46 41.63,65.09 R13.1 | v40.36,36.84 42.27,36.84 45.45,40.01 v46.4,40.01
  Top 0.813: J6.2 17.14,29.8 16.87,29.54 J7.3
  Bottom 0.305: J2.9 30.84,68.91 31.16,68.59 36.24,68.59 36.87,67.95 38.46,67.95 39.09,67.32 40.68,67.32 41.32,66.68 42.91,66.68 43.54,66.05 45.13,66.05 46.4,64.78 v46.4,64.14 46.4,63.51 46.72,63.19 46.72,41.28 46.4,40.97 v46.4,40.01 46.4,39.06 46.4,38.11 54.65,29.85 57.19,29.85 v58.78,31.44 | J7.3 18.14,29.54 20.36,31.76 21.95,31.76 23.22,30.49 32.11,30.49 40.05,30.49 41,30.49 41.63,31.12 41.63,31.76 41.63,34.3 40.36,35.57 v40.36,36.84
IO22  (via drill 0.5)
  Top 0.305: U1.36 67.35,25.41 67.03,25.73 66.72,25.73 64.81,27.63 63.23,27.63 61.95,28.9 60.37,28.9 59.57,29.69 v59.57,30.49 | R14.1 43.22,63.83 45.13,63.83 45.76,63.19 v45.76,62.55 | v45.45,38.74 45.13,38.74 42.27,35.89 v41.32,35.89
  Top 0.813: J6.1 17.2,27.8 16.39,27 J7.4
  Bottom 0.305: J2.10 28.3,68.91 29.25,67.95 31.48,67.95 32.11,67.95 35.92,67.95 36.55,67.32 38.14,67.32 38.78,66.68 40.36,66.68 41,66.05 42.59,66.05 43.22,65.41 44.17,65.41 44.81,65.41 45.45,64.78 45.45,63.51 45.76,63.19 v45.76,62.55 45.76,61.92 46.08,61.6 46.08,41.6 45.76,41.28 45.45,40.97 v45.45,38.74 45.45,38.11 54.34,29.22 57.51,29.22 58.78,30.49 v59.57,30.49 | J7.4 17.51,27 20.36,29.85 29.57,29.85 29.89,29.85 31.79,29.85 41.32,29.85 42.27,30.8 42.27,34.62 41.32,35.57 v41.32,35.89
IO23  (via drill 0.5)
  Top 0.305: U1.37 68.62,25.41 67.67,26.36 67.03,26.36 65.13,28.27 63.54,28.27 62.27,29.54 60.69,29.54 60.37,29.85 60.37,31.12 58.78,32.71 v58.15,32.71
  Bottom 0.305: v58.15,32.71 54.65,32.71 48.62,38.74 48.62,65.41 48.3,65.73 46.08,67.95 44.49,67.95 43.54,68.91 J2.4
IO25  (via drill 0.5)
  Top 0.305: U1.10 58.46,40.97 60.37,39.06 v61,39.06
  Bottom 0.305: J3.2 70.21,23.18 68.31,25.09 68.31,33.03 62.27,39.06 v61,39.06
IO26  (via drill 0.5)
  Top 0.305: U1.11 57.19,41.28 v60.37,38.11
  Bottom 0.305: v60.37,38.11 60.05,38.42 60.05,39.7 60.37,40.01 62.27,40.01 68.94,33.34 68.94,25.41 70.84,23.5 72.43,21.91 J3.1
IO27  (via drill 0.5)
  Top 0.305: v55.92,40.89 U1.12
  Bottom 0.305: J1.8 54.97,45.09 52.43,42.55 51.8,41.92 51.8,40.33 52.75,39.38 54.34,39.38 55.84,40.89 v55.92,40.89
IO32  (via drill 0.5)
  Top 0.305: U1.8 61,41.28 62.59,39.7 62.59,38.11 61,36.52 57.51,36.52 56.24,37.79 55.6,37.79 54.65,36.84 v53.7,36.84
  Bottom 0.305: v53.7,36.84 53.38,36.84 50.52,39.7 50.52,66.37 48.62,68.27 J2.2
IO33  (via drill 0.5)
  Top 0.305: U1.9 59.73,40.65 60.37,40.01 61.32,40.01 61.95,39.38 61.95,38.42 60.69,37.16 57.83,37.16 56.24,38.74 v54.97,38.74
  Bottom 0.305: v54.97,38.74 52.43,38.74 51.16,40.01 J2.1
IO34  (via drill 0.5)
  Top 0.305: v66.72,32.08 67.03,32.39 67.03,36.2 64.18,39.06 64.18,40.01 63.54,40.65 U1.6
  Bottom 0.305: v66.72,32.08 67.03,31.76 67.03,25.09 65.13,23.18 J3.4
IO35  (via drill 0.5)
  Top 0.305: U1.7 62.27,40.97 63.54,39.7 63.54,38.74 66.4,35.89 66.4,33.34 v66.08,33.03
  Bottom 0.305: J3.3 67.67,32.71 67.35,33.03 v66.08,33.03
IO36  (via drill 0.5)
  Top 0.305: v65.13,30.49 65.45,30.17 67.03,30.17 68.31,31.44 68.31,36.84 65.45,39.7 65.45,40.65 66.08,41.28 U1.4
  Bottom 0.305: v65.13,30.49 65.77,29.85 65.77,25.73 64.18,24.14 62.59,24.14 61.95,23.5 60.37,23.5 60.05,23.18 J3.6
IO39  (via drill 0.5)
  Top 0.305: v66.08,31.12 67.03,31.12 67.67,31.76 67.67,36.52 64.81,39.38 U1.5
  Bottom 0.305: J3.5 62.59,23.18 62.91,23.5 64.5,23.5 66.4,25.41 66.4,30.8 v66.08,31.12
N$1
  Top 0.61: 77.83,4.13 76.56,5.4 | 76.56,2.86 77.83,4.13 | 77.83,4.13 75.29,4.13
N$2
  Top 0.61: 11.79,4.13 9.25,4.13 11.79,4.13 | 11.79,4.13 10.52,5.4 | 10.52,2.86 11.79,4.13
N$3  (via drill 0.5)
  Top 0.305: USB1.B5 15.01,56.73 14.17,55.89 v13.7,55.89
  Top 0.61: R2.2 14.01,50.49 v13.7,50.81
  Bottom 0.305: v13.7,50.81 13.7,54.62 | 13.7,54.62 v13.7,55.89 | TP6.TP 13.7,54.62
N$4  (via drill 0.5)
  Top 0.254: v18.77,58.9 18.3,58.9 17.87,58.48 USB1.A5
  Top 0.61: v13.7,64.14 14.01,64.46 R1.2
  Bottom 0.305: v13.7,64.14 13.7,63.83 13.7,60.65 14.01,60.33 TP5.TP 14.96,59.38 15.44,58.9 v18.77,58.9
N$5
  Top 0.61: 77.83,87.95 76.56,89.22 | 76.56,86.69 77.83,87.95 | 77.83,87.95 75.29,87.95
N$6
  Top 0.254: U2.3 28.37,53.28 27.98,53.66 R3.2
N$7
  Top 0.254: U2.4 28.37,52.78 27.98,52.4 R4.2
N$8
  Top 0.305: U2.8 30.41,50.38 30.2,50.17 R5.1
  Top 0.61: R6.1 R5.1
N$9  (via drill 0.9)
  Top 0.61: C15.2 20.81,46.55 20.36,47 20.27,47.09 U3.3
  Top 1.27: F1.2 v16.87,39.06 C18.2 | U3.3 15.69,47.09 v15.6,47
  Bottom 1.27: v16.87,39.06 16.23,39.06 15.6,39.7 v15.6,47
N$10
  Top 0.61: LED1.- R11.2
N$11
  Top 0.305: Q1.1 37.83,54.11 R9.2
N$12
  Top 0.305: Q2.1 39.73,51.95 R10.2
N$13
  Top 0.61: C24.2 34.65,31.12
  Top 1.27: 32.27,31.28 32.43,31.12 34.65,31.12 35.92,31.12 36.49,31.69 D4.C 36.52,33.37 Q5.2 | 32.27,31.28 31.79,31.76 30.43,33.12 U4.3 28.32,34.29 D3.1 | C23.2 32.75,30.8 32.27,31.28
N$14
  Top 0.254: U2.9 30.91,50.42 31.16,50.17 32.43,50.17 32.75,49.86 R7.2
N$15
  Top 0.61: R12.2 35.6,61.6 35.67,61.54 LED2.-
N$16
  Top 0.305: C8.2 34.27,53.92 33.7,53.35 33.63,53.28 U2.16
N$17
  Top 0.61: R17.2 34.61,34.93 Q5.1
  Top 1.27: Q5.1 34.1,34.86 33.86,34.62 | 33.86,34.62 33.54,34.3 | D4.A 33.44,34.2 33.86,34.62
RTS  (via drill 0.5)
  Top 0.254: v36.24,56.52 36.24,55.57 35.67,55.01 U2.19
  Top 0.305: v39.09,53.66 39.41,53.98 39.73,53.98 | 39.73,53.98 39.86,53.98 R10.1 | Q1.2 39.73,53.98
  Bottom 0.305: v39.09,53.66 37.83,53.66 36.24,55.25 v36.24,56.52
RXD  (via drill 0.5)
  Top 0.254: U2.21 31.41,55.82 32.43,56.84 34.02,56.84 v34.33,56.52
  Top 0.305: U1.34 64.81,25.73 64.18,26.36 62.27,26.36 v61.64,27
  Bottom 0.305: J5.3 26.24,61.76 25.76,62.24 25.76,65.09 27.35,66.68 31.16,66.68 32.43,65.41 32.43,62.55 33.06,61.92 33.06,58.43 34.33,57.16 v34.33,56.52 34.33,55.25 41,48.59 41,40.65 43.86,37.79 53.7,27.95 58.15,27.95 59.1,28.9 60.05,28.9 61,28.9 61.64,28.27 v61.64,27 59.1,27 58.78,26.68 53.7,26.68 51.8,26.68 38.14,26.68 36.55,26.68 34.65,24.77 J4.9
TXD  (via drill 0.5)
  Top 0.254: U2.20 31.91,55.69 32.43,56.2 33.06,56.2 v33.38,55.89
  Top 0.305: v60.69,27.95 61.95,27.95 62.91,27 64.5,27 66.08,25.41 U1.35
  Bottom 0.305: J5.1 27.51,65.57 27.98,66.05 30.84,66.05 31.79,65.09 31.79,62.24 32.43,61.6 32.43,58.11 33.38,57.16 v33.38,55.89 33.38,55.25 40.36,48.27 40.36,40.33 43.22,37.47 53.06,27.63 53.06,27.31 | 53.06,27.31 54.02,27.31 58.46,27.31 59.1,27.95 v60.69,27.95 | 53.06,27.31 37.83,27.31 36.24,27.31 32.11,23.18 J4.10
V_USB  (via drill 0.7)
  Top 0.305: 17.89,55.98 USB1.A9 16.62,55.98 16.37,56.23 USB1.B4 15.3,56.23 14.96,55.89 14.01,54.94 | 22.58,66.68 22.27,66.37 22.27,63.51 17.73,58.98 USB1.A4 16.62,58.98 16.37,58.73 USB1.B9 14.98,58.73 14.96,58.74 14.65,59.06 14.01,59.06
  Top 0.61: 17.89,55.98 19.89,53.98 | U5.5 22.58,66.68 | 14.01,59.06 v13.38,59.06 12.74,58.43 12.74,55.41 13.22,54.94 14.01,54.94 | C1.2 23.95,56.2 USB2.VBUS | R5.2 30.2,46.05 30.2,45.73 30.2,45.41
  Top 0.813: USB2.VBUS 23.93,53.98 | 19.89,53.98 23.93,53.98 | 23.93,53.98 23.93,51.37 23.93,47.87 26.08,45.73 26.39,45.41 30.2,45.41 35.28,45.41 35.6,45.09 Q3.3 Q4.3
  Bottom 0.61: v13.38,59.06 13.06,59.06 11.79,60.33 TP1.TP
VCCIO  (via drill 0.6, 0.9)
  Top 0.61: 34.33,41.28 34.65,41.6 34.69,41.64 Q3.1 | v26.71,41.92 26.71,40.65 | C21.2 23.66,35.63 C20.2 C19.2
  Top 0.813: Q4.1 34.69,39.66 34.33,40.01 v34.33,40.65 34.33,41.28
  Top 1.27: 25.44,30.8 26.71,30.8 26.71,35.57 | 25.44,30.8 U4.4 | D1.2 27.35,43.5 26.71,42.87 v26.71,41.92 26.71,40.65 26.71,40.33 | 26.71,40.33 26.71,35.57 | D2.2 26.71,40.33 | C21.2 26.65,35.63 26.71,35.57 | U4.2 25.44,30.8
  Bottom 1.27: v26.71,41.92 26.71,42.23 27.35,42.87 33.7,42.87 34.33,42.23 v34.33,40.65
VIN  (via drill 0.9)
  Top 0.61: C25.2 39.6,38.81 C26.2 | C32.2 50.52,24.45 50.68,24.3
  Top 1.27: 39.09,35.89 41.32,33.66 47.98,27 50.21,24.77 50.68,24.3 51.16,23.82 v51.16,23.5 | 39.09,35.89 38.46,36.52 | 38.46,36.52 38.14,36.84 | 36.87,36.91 Q5.3 32.72,36.91 D3.2 D2.1 | 36.87,36.91 38.07,36.91 38.46,36.52 | Q4.2 36.52,36.91 36.87,36.91 | C25.2 38.46,36.52 | 38.46,36.52 39.09,35.89
  Bottom 1.27: v51.16,23.5 51.48,23.82 53.06,23.82 54.34,23.82 54.97,23.18 J4.1

## Text on the board
tPlace: LAMLOEI UMO32C | 22 | 21 | 5V | GND | 18 | 19 | 23 | 5 | 32 | 33 | 27 | 14 | 12 | 13 | 15 | 2 | 17 | 16 | EN | SCL | SDA | 5V | GND | SCK | MISO | MOSI | SS | T9 | T8 | T7 | T6 | T5 | T4 | T3 | T2 | TX2 | RX2 | TXD | 5V | P | BOOT | L | RXD | GND | IO2 | DP | DM | LAMLOEI | EN | GND | VU | UMO32C | G | 5V | SDA | SCL | BOOT | NC | 4 | TXD | RXD | 0 | 3V3 | EN | 3V3 | 5V | GND | VIN | 36 | 39 | 34 | 35 | 25 | 26 | 20191212 R2.1
bPlace: VU | CC1 | DP | DM | -DM | +DP | GND | CC2 | GND | VU | GND | 5V | SDA | SCL
tDocu: J2 | J1 | K1 | U5 | C9 | 100n | R13 | 100K | R1 | 5K1 | J5 | R11 | 2K2 | LED1 | BLU | R14 | 100K | R12 | 2K2 | LED2 | YEL | C10 | 100n | C11 | 100n | C12 | R15 | 100n | 12K | C13 | 4U7 | USB1 | USB2 | C1 | 100n | Q1 | C14 | C2 | NC | 4U7 | R3 | 0 | U2 | C8 | R9 | R10 | R4 | 0 | CP2104 | 4U7 | 12K | 12K | C3 | NC | R2 | 5K1 | C4 | 4U7 | R5 | R6 | R7 | C6 | R8 | C7 | Q2 | C35 | 470U | D5 | 24K | 47K | 12K | 100n | 12K | 100n | C39 | C38 | C37 | C36 | C15 | C5 | 100n | 10p | 100p | 1n | 10n | C34 | 4U7 | 100n | U3 | C33 | 100n | 1117-3.3 | C16 | D1 | Q3 | C17 | 100n | 4U7 | D2 | C25 | C26 | C27 | C28 | F1 | C18 | 4U7 | Q4 | 100n | 100n | 4U7 | 4U7 | C21 | D3 | C19 | 100n | C20 | 100n | ESP32-WROOM-32 | U1 | 4U7 | Q5 | C22 | R17 | 100K | J7 | 100n | D4 | U4 | R16 | J6 | 1117-5.0 | 12K | C23 | C24 | 100n | 4U7 | C29 | 100n | C30 | 100n | C31 | 100n | C32 | 100n | K2 | J4 | J3
214bmp: D:/SmartProjects/Snc/a4_bn_logo2.bmp